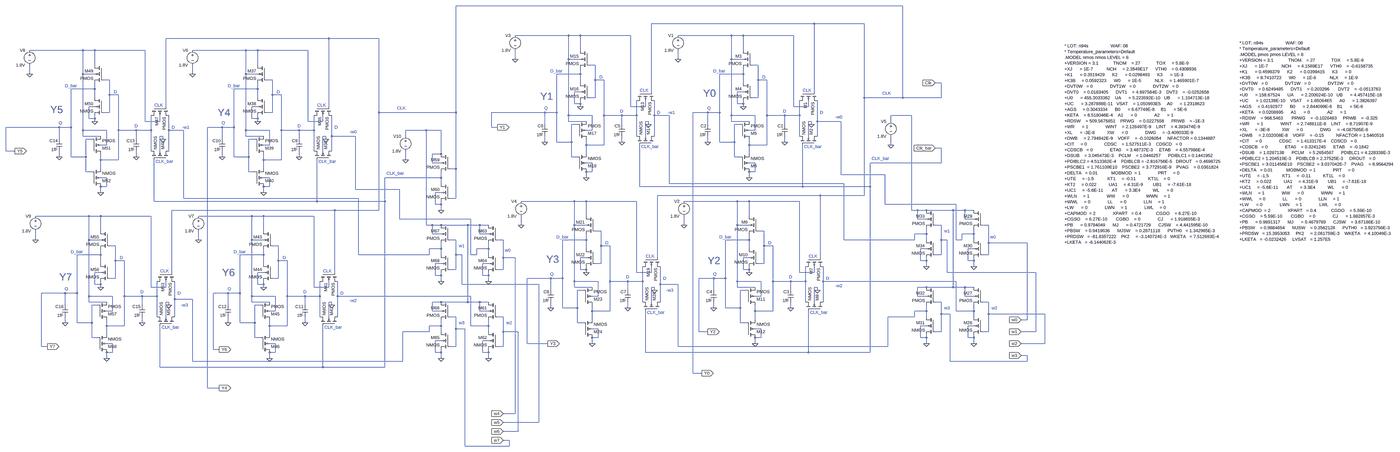
[diagram p0: schematic 8-bit_Memory.asc, whole sheet]
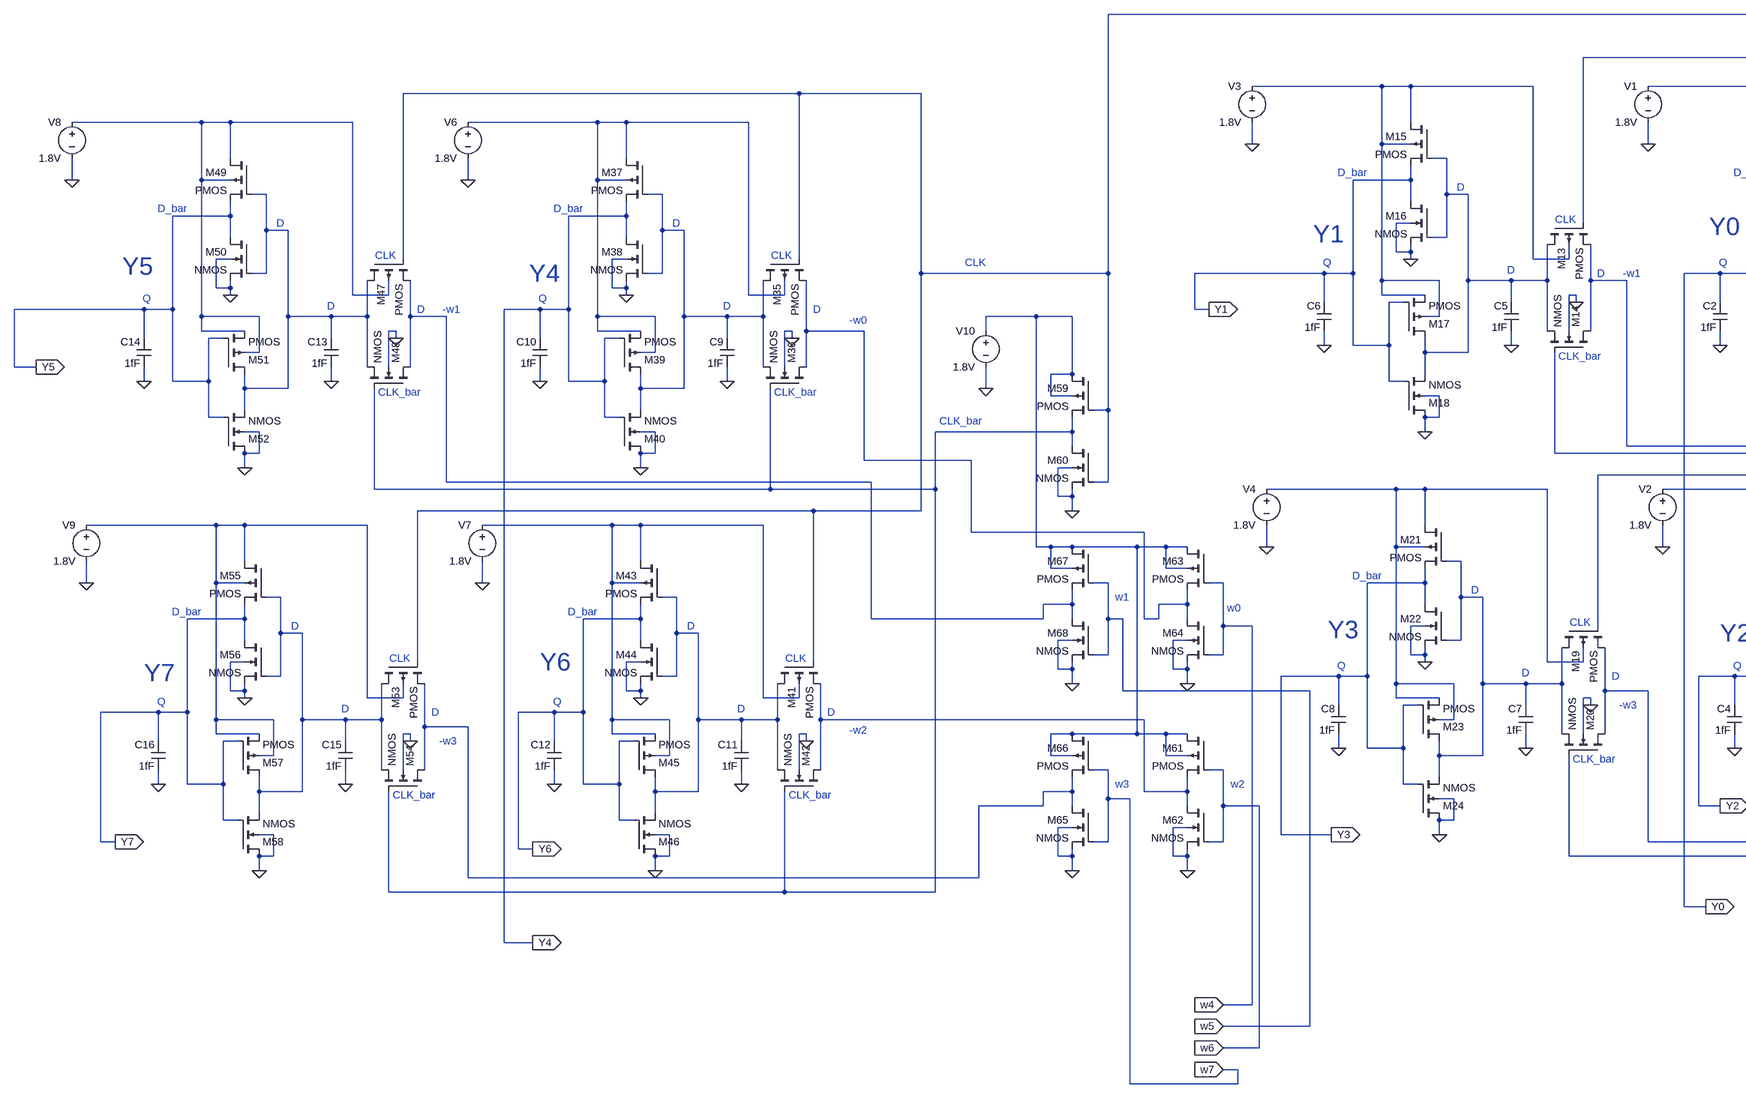
[diagram p1: schematic 8-bit_Memory.asc, part, row 1 of 1, column 1 of 2]
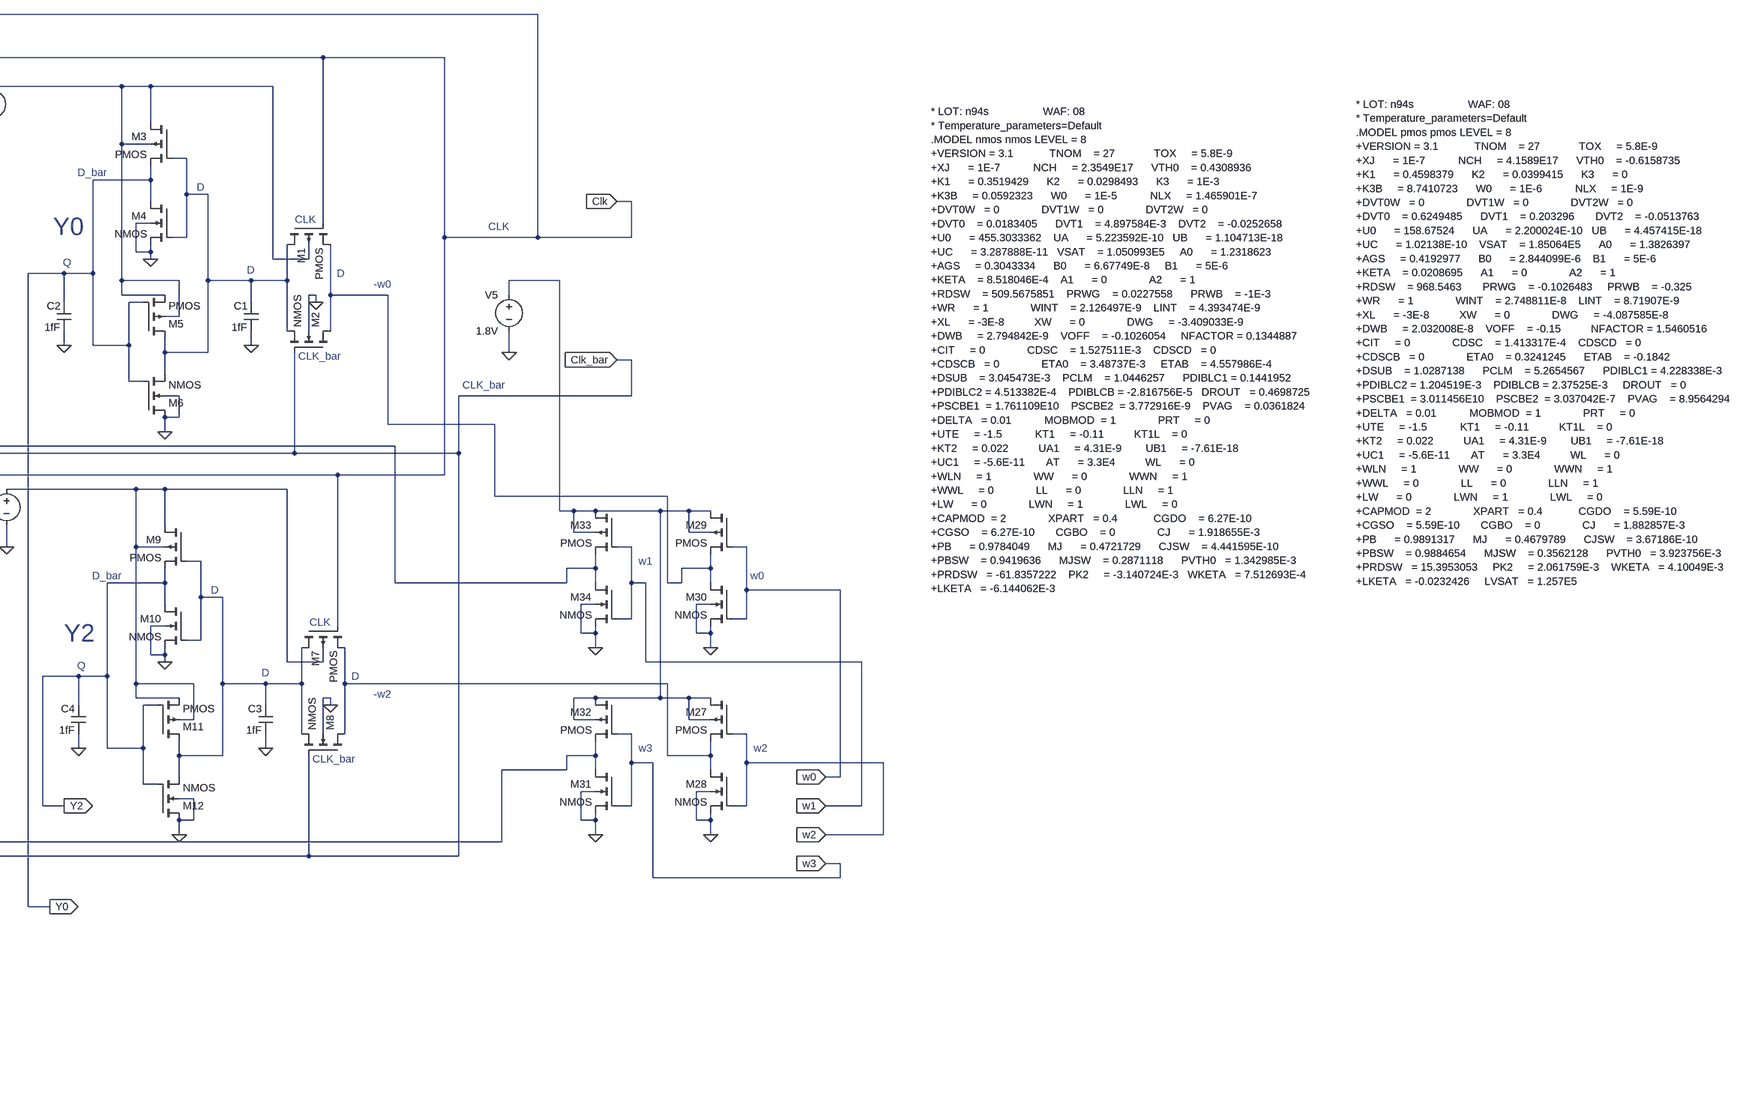
[diagram p2: schematic 8-bit_Memory.asc, part, row 1 of 1, column 2 of 2]
8-bit_Memory.asc, the LTspice schematic file:
Version 4
SHEET 1 5848 1960
WIRE 2896 -480 416 -480
WIRE 2352 -384 1472 -384
WIRE 2688 -384 2352 -384
WIRE 1024 -320 736 -320
WIRE 1088 -320 1024 -320
WIRE 1360 -320 1088 -320
WIRE 1904 -320 1616 -320
WIRE 1968 -320 1904 -320
WIRE 2240 -320 1968 -320
WIRE -336 -304 -1216 -304
WIRE 0 -304 -336 -304
WIRE -1664 -240 -1952 -240
WIRE -1600 -240 -1664 -240
WIRE -1328 -240 -1600 -240
WIRE -784 -240 -1072 -240
WIRE -720 -240 -784 -240
WIRE -448 -240 -720 -240
WIRE 1088 -240 1088 -320
WIRE 1968 -240 1968 -320
WIRE 736 -192 736 -240
WIRE 1024 -192 1024 -320
WIRE 1088 -192 1024 -192
WIRE 1616 -192 1616 -240
WIRE 1904 -192 1904 -320
WIRE 1968 -192 1904 -192
WIRE -1600 -160 -1600 -240
WIRE -720 -160 -720 -240
WIRE 1168 -160 1136 -160
WIRE 2048 -160 2016 -160
WIRE -1952 -112 -1952 -160
WIRE -1664 -112 -1664 -240
WIRE -1600 -112 -1664 -112
WIRE -1072 -112 -1072 -160
WIRE -784 -112 -784 -240
WIRE -720 -112 -784 -112
WIRE 1088 -112 1088 -144
WIRE 1088 -112 960 -112
WIRE 1968 -112 1968 -144
WIRE 1968 -112 1840 -112
WIRE -1520 -80 -1552 -80
WIRE -640 -80 -672 -80
WIRE 1168 -80 1168 -160
WIRE 1216 -80 1168 -80
WIRE 2048 -80 2048 -160
WIRE 2096 -80 2048 -80
WIRE 1088 -64 1088 -112
WIRE 1968 -64 1968 -112
WIRE 3104 -64 3072 -64
WIRE -1600 -32 -1600 -64
WIRE -1600 -32 -1728 -32
WIRE -720 -32 -720 -64
WIRE -720 -32 -848 -32
WIRE 1088 -16 1056 -16
WIRE 1472 -16 1472 -384
WIRE 1968 -16 1936 -16
WIRE 2352 -16 2352 -384
WIRE -1520 0 -1520 -80
WIRE -1472 0 -1520 0
WIRE -640 0 -640 -80
WIRE -592 0 -640 0
WIRE -1600 16 -1600 -32
WIRE -720 16 -720 -32
WIRE 1168 16 1168 -80
WIRE 1168 16 1136 16
WIRE 2048 16 2048 -80
WIRE 2048 16 2016 16
WIRE 2688 16 2688 -384
WIRE 2896 16 2896 -480
WIRE 2896 16 2688 16
WIRE 3104 16 3104 -64
WIRE 3104 16 2896 16
WIRE 1056 48 1056 -16
WIRE 1088 48 1088 32
WIRE 1088 48 1056 48
WIRE 1936 48 1936 -16
WIRE 1968 48 1968 32
WIRE 1968 48 1936 48
WIRE -1600 64 -1632 64
WIRE -1216 64 -1216 -304
WIRE -720 64 -752 64
WIRE -336 64 -336 -304
WIRE 1088 64 1088 48
WIRE 1360 64 1360 -320
WIRE 1440 64 1440 32
WIRE 1440 64 1360 64
WIRE 1968 64 1968 48
WIRE 2240 64 2240 -320
WIRE 2320 64 2320 32
WIRE 2320 64 2240 64
WIRE -1520 96 -1520 0
WIRE -1520 96 -1552 96
WIRE -640 96 -640 0
WIRE -640 96 -672 96
WIRE 0 96 0 -304
WIRE 416 96 416 -480
WIRE 416 96 0 96
WIRE 896 96 608 96
WIRE 960 96 960 -112
WIRE 960 96 896 96
WIRE 1776 96 1696 96
WIRE 1840 96 1840 -112
WIRE 1840 96 1776 96
WIRE 1024 112 1024 -192
WIRE 1152 112 1024 112
WIRE 1216 112 1216 -80
WIRE 1312 112 1216 112
WIRE 1392 112 1392 32
WIRE 1392 112 1312 112
WIRE 1488 112 1488 32
WIRE 1568 112 1488 112
WIRE 1904 112 1904 -192
WIRE 2032 112 1904 112
WIRE 2096 112 2096 -80
WIRE 2192 112 2096 112
WIRE 2272 112 2272 32
WIRE 2272 112 2192 112
WIRE 2944 112 2832 112
WIRE -1632 128 -1632 64
WIRE -1600 128 -1600 112
WIRE -1600 128 -1632 128
WIRE -752 128 -752 64
WIRE -720 128 -720 112
WIRE -720 128 -752 128
WIRE -1600 144 -1600 128
WIRE -1328 144 -1328 -240
WIRE -1248 144 -1248 112
WIRE -1248 144 -1328 144
WIRE -720 144 -720 128
WIRE -448 144 -448 -240
WIRE -368 144 -368 112
WIRE -368 144 -448 144
WIRE 1024 144 1024 112
WIRE 1120 144 1024 144
WIRE 1456 144 1440 144
WIRE 1904 144 1904 112
WIRE 2000 144 1904 144
WIRE 2336 144 2320 144
WIRE 2368 144 2368 32
WIRE 2496 144 2368 144
WIRE 2832 144 2832 112
WIRE 896 160 896 96
WIRE 1072 160 1040 160
WIRE 1312 160 1312 112
WIRE 1456 160 1456 144
WIRE 1776 160 1776 96
WIRE 1952 160 1920 160
WIRE 2192 160 2192 112
WIRE 2336 160 2336 144
WIRE -1792 176 -2080 176
WIRE -1728 176 -1728 -32
WIRE -1728 176 -1792 176
WIRE -912 176 -992 176
WIRE -848 176 -848 -32
WIRE -848 176 -912 176
WIRE 608 176 608 96
WIRE 640 176 608 176
WIRE -1664 192 -1664 -112
WIRE -1536 192 -1664 192
WIRE -1472 192 -1472 0
WIRE -1376 192 -1472 192
WIRE -1296 192 -1296 112
WIRE -1296 192 -1376 192
WIRE -1200 192 -1200 112
WIRE -1120 192 -1200 192
WIRE -784 192 -784 -112
WIRE -656 192 -784 192
WIRE -592 192 -592 0
WIRE -496 192 -592 192
WIRE -416 192 -416 112
WIRE -416 192 -496 192
WIRE 256 192 144 192
WIRE 336 192 256 192
WIRE 1152 192 1152 112
WIRE 1152 192 1120 192
WIRE 2032 192 2032 112
WIRE 2032 192 2000 192
WIRE -1664 224 -1664 192
WIRE -1568 224 -1664 224
WIRE -1232 224 -1248 224
WIRE -784 224 -784 192
WIRE -688 224 -784 224
WIRE -352 224 -368 224
WIRE -320 224 -320 112
WIRE -192 224 -320 224
WIRE 144 224 144 192
WIRE 1392 224 1392 112
WIRE 1440 224 1440 144
WIRE 1488 224 1488 112
WIRE 2272 224 2272 112
WIRE 2320 224 2320 144
WIRE 2368 224 2368 144
WIRE -1792 240 -1792 176
WIRE -1616 240 -1648 240
WIRE -1376 240 -1376 192
WIRE -1232 240 -1232 224
WIRE -912 240 -912 176
WIRE -736 240 -768 240
WIRE -496 240 -496 192
WIRE -352 240 -352 224
WIRE 896 256 896 224
WIRE 960 256 960 96
WIRE 1040 256 1040 160
WIRE 1040 256 960 256
WIRE 1312 256 1312 224
WIRE 1776 256 1776 224
WIRE 1840 256 1840 96
WIRE 1920 256 1920 160
WIRE 1920 256 1840 256
WIRE 2192 256 2192 224
WIRE -1536 272 -1536 192
WIRE -1536 272 -1568 272
WIRE -656 272 -656 192
WIRE -656 272 -688 272
WIRE 1120 272 1120 240
WIRE 1216 272 1216 112
WIRE 1216 272 1120 272
WIRE 2000 272 2000 240
WIRE 2096 272 2096 112
WIRE 2096 272 2000 272
WIRE 2832 272 2832 224
WIRE 3104 288 3072 288
WIRE -2080 304 -2080 176
WIRE -2032 304 -2080 304
WIRE -1296 304 -1296 192
WIRE -1248 304 -1248 224
WIRE -1200 304 -1200 192
WIRE -416 304 -416 192
WIRE -368 304 -368 224
WIRE -320 304 -320 224
WIRE 336 320 336 192
WIRE 336 320 288 320
WIRE 1120 320 1120 272
WIRE 2000 320 2000 272
WIRE -1792 336 -1792 304
WIRE -1728 336 -1728 176
WIRE -1648 336 -1648 240
WIRE -1648 336 -1728 336
WIRE -1376 336 -1376 304
WIRE -912 336 -912 304
WIRE -848 336 -848 176
WIRE -768 336 -768 240
WIRE -768 336 -848 336
WIRE -496 336 -496 304
WIRE 1040 336 1040 256
WIRE 1072 336 1040 336
WIRE 1920 336 1920 256
WIRE 1952 336 1920 336
WIRE -1568 352 -1568 320
WIRE -1472 352 -1472 192
WIRE -1472 352 -1568 352
WIRE -688 352 -688 320
WIRE -592 352 -592 192
WIRE -592 352 -688 352
WIRE 144 352 144 304
WIRE 288 368 288 320
WIRE 336 368 288 368
WIRE 1152 368 1120 368
WIRE 2032 368 2000 368
WIRE 3104 368 3104 288
WIRE 3104 368 2720 368
WIRE -1568 400 -1568 352
WIRE -688 400 -688 352
WIRE 416 400 416 96
WIRE 416 400 384 400
WIRE -1648 416 -1648 336
WIRE -1616 416 -1648 416
WIRE -768 416 -768 336
WIRE -736 416 -768 416
WIRE 1152 416 1152 368
WIRE 1152 416 1120 416
WIRE 2032 416 2032 368
WIRE 2032 416 2000 416
WIRE 2496 432 2496 144
WIRE 2800 432 2496 432
WIRE -1536 448 -1568 448
WIRE -656 448 -688 448
WIRE 336 448 336 416
WIRE 336 448 32 448
WIRE 1120 448 1120 416
WIRE 2000 448 2000 416
WIRE 336 480 336 448
WIRE 1568 480 1568 112
WIRE 2512 480 1568 480
WIRE -1536 496 -1536 448
WIRE -1536 496 -1568 496
WIRE -656 496 -656 448
WIRE -656 496 -688 496
WIRE 1408 496 1408 272
WIRE 2288 496 2288 272
WIRE 2288 496 1408 496
WIRE 2720 496 2720 368
WIRE 2720 496 2288 496
WIRE -192 512 -192 224
WIRE 112 512 -192 512
WIRE -1568 528 -1568 496
WIRE -688 528 -688 496
WIRE 336 528 304 528
WIRE 2384 544 1504 544
WIRE 2688 544 2688 16
WIRE 2688 544 2384 544
WIRE -1120 560 -1120 192
WIRE -176 560 -1120 560
WIRE 416 560 416 400
WIRE 416 560 384 560
WIRE -1280 576 -1280 352
WIRE -400 576 -400 352
WIRE -400 576 -1280 576
WIRE 32 576 32 448
WIRE 32 576 -400 576
WIRE 1056 576 768 576
WIRE 1120 576 1056 576
WIRE 1392 576 1120 576
WIRE 1936 576 1648 576
WIRE 2000 576 1936 576
WIRE 2272 576 2000 576
WIRE 304 592 304 528
WIRE 336 592 336 576
WIRE 336 592 304 592
WIRE 2800 592 2800 432
WIRE 3184 592 2800 592
WIRE -304 624 -1184 624
WIRE 0 624 0 96
WIRE 0 624 -304 624
WIRE 336 624 336 592
WIRE 2944 624 2944 112
WIRE 2976 624 2944 624
WIRE 3024 624 2976 624
WIRE 3168 624 3024 624
WIRE 3232 624 3168 624
WIRE 3280 624 3232 624
WIRE -1632 656 -1920 656
WIRE -1568 656 -1632 656
WIRE -1296 656 -1568 656
WIRE -752 656 -1040 656
WIRE -688 656 -752 656
WIRE -416 656 -688 656
WIRE 1120 656 1120 576
WIRE 2000 656 2000 576
WIRE 112 672 112 512
WIRE 496 672 112 672
WIRE 2976 672 2976 624
WIRE 3024 672 2976 672
WIRE 3232 672 3232 624
WIRE 3280 672 3232 672
WIRE 256 704 256 192
WIRE 288 704 256 704
WIRE 336 704 288 704
WIRE 480 704 336 704
WIRE 544 704 480 704
WIRE 592 704 544 704
WIRE 768 704 768 656
WIRE 1056 704 1056 576
WIRE 1120 704 1056 704
WIRE 1648 704 1648 656
WIRE 1936 704 1936 576
WIRE 2000 704 1936 704
WIRE 3104 704 3072 704
WIRE 3360 704 3328 704
WIRE -1568 736 -1568 656
WIRE -688 736 -688 656
WIRE 1200 736 1168 736
WIRE 2080 736 2048 736
WIRE 288 752 288 704
WIRE 336 752 288 752
WIRE 544 752 544 704
WIRE 592 752 544 752
WIRE 3024 752 3024 720
WIRE 3024 752 2960 752
WIRE 3280 752 3280 720
WIRE 3280 752 3216 752
WIRE -1920 784 -1920 736
WIRE -1632 784 -1632 656
WIRE -1568 784 -1632 784
WIRE -1040 784 -1040 736
WIRE -752 784 -752 656
WIRE -688 784 -752 784
WIRE 416 784 384 784
WIRE 672 784 640 784
WIRE 1120 784 1120 752
WIRE 1120 784 992 784
WIRE 2000 784 2000 752
WIRE 2000 784 1872 784
WIRE 2512 784 2512 480
WIRE 2960 784 2960 752
WIRE 2960 784 2512 784
WIRE 3024 784 3024 752
WIRE 3104 784 3104 704
WIRE 3136 784 3104 784
WIRE 3184 784 3184 592
WIRE 3216 784 3216 752
WIRE 3216 784 3184 784
WIRE 3280 784 3280 752
WIRE 3360 800 3360 704
WIRE 3568 800 3360 800
WIRE -1488 816 -1520 816
WIRE -608 816 -640 816
WIRE 1200 816 1200 736
WIRE 1248 816 1200 816
WIRE 2080 816 2080 736
WIRE 2128 816 2080 816
WIRE 336 832 336 800
WIRE 336 832 272 832
WIRE 592 832 592 800
WIRE 592 832 528 832
WIRE 1120 832 1120 784
WIRE 2000 832 2000 784
WIRE 3024 832 2992 832
WIRE 3280 832 3248 832
WIRE -1568 864 -1568 832
WIRE -1568 864 -1696 864
WIRE -688 864 -688 832
WIRE -688 864 -816 864
WIRE -176 864 -176 560
WIRE 272 864 272 832
WIRE 272 864 -176 864
WIRE 336 864 336 832
WIRE 416 864 416 784
WIRE 448 864 416 864
WIRE 496 864 496 672
WIRE 528 864 528 832
WIRE 528 864 496 864
WIRE 592 864 592 832
WIRE 3104 864 3104 784
WIRE 3104 864 3072 864
WIRE 3360 864 3360 800
WIRE 3360 864 3328 864
WIRE 672 880 672 784
WIRE 736 880 672 880
WIRE 1120 880 1088 880
WIRE 1504 880 1504 544
WIRE 2000 880 1968 880
WIRE 2384 880 2384 544
WIRE -1488 896 -1488 816
WIRE -1440 896 -1488 896
WIRE -608 896 -608 816
WIRE -560 896 -608 896
WIRE 2992 896 2992 832
WIRE 3024 896 3024 880
WIRE 3024 896 2992 896
WIRE 3248 896 3248 832
WIRE 3280 896 3280 880
WIRE 3280 896 3248 896
WIRE -1568 912 -1568 864
WIRE -688 912 -688 864
WIRE 336 912 304 912
WIRE 592 912 560 912
WIRE 1200 912 1200 816
WIRE 1200 912 1168 912
WIRE 2080 912 2080 816
WIRE 2080 912 2048 912
WIRE 3024 928 3024 896
WIRE 3280 928 3280 896
WIRE 416 944 416 864
WIRE 416 944 384 944
WIRE 672 944 672 880
WIRE 672 944 640 944
WIRE 1088 944 1088 880
WIRE 1120 944 1120 928
WIRE 1120 944 1088 944
WIRE 1968 944 1968 880
WIRE 2000 944 2000 928
WIRE 2000 944 1968 944
WIRE -1568 960 -1600 960
WIRE -1184 960 -1184 624
WIRE -688 960 -720 960
WIRE -304 960 -304 624
WIRE 1120 960 1120 944
WIRE 1392 960 1392 576
WIRE 1472 960 1472 928
WIRE 1472 960 1392 960
WIRE 2000 960 2000 944
WIRE 2272 960 2272 576
WIRE 2352 960 2352 928
WIRE 2352 960 2272 960
WIRE 3136 960 3136 784
WIRE 3616 960 3136 960
WIRE 304 976 304 912
WIRE 336 976 336 960
WIRE 336 976 304 976
WIRE 560 976 560 912
WIRE 592 976 592 960
WIRE 592 976 560 976
WIRE -1488 992 -1488 896
WIRE -1488 992 -1520 992
WIRE -608 992 -608 896
WIRE -608 992 -640 992
WIRE 928 992 800 992
WIRE 992 992 992 784
WIRE 992 992 928 992
WIRE 1808 992 1728 992
WIRE 1872 992 1872 784
WIRE 1872 992 1808 992
WIRE 336 1008 336 976
WIRE 592 1008 592 976
WIRE 1056 1008 1056 704
WIRE 1184 1008 1056 1008
WIRE 1248 1008 1248 816
WIRE 1344 1008 1248 1008
WIRE 1424 1008 1424 928
WIRE 1424 1008 1344 1008
WIRE 1936 1008 1936 704
WIRE 2064 1008 1936 1008
WIRE 2128 1008 2128 816
WIRE 2224 1008 2128 1008
WIRE 2304 1008 2304 928
WIRE 2304 1008 2224 1008
WIRE 2400 1008 2400 928
WIRE 3184 1008 2400 1008
WIRE -1600 1024 -1600 960
WIRE -1568 1024 -1568 1008
WIRE -1568 1024 -1600 1024
WIRE -720 1024 -720 960
WIRE -688 1024 -688 1008
WIRE -688 1024 -720 1024
WIRE 448 1024 448 864
WIRE 864 1024 448 1024
WIRE 1520 1024 1520 928
WIRE 1616 1024 1520 1024
WIRE -1568 1040 -1568 1024
WIRE -1296 1040 -1296 656
WIRE -1216 1040 -1216 1008
WIRE -1216 1040 -1296 1040
WIRE -688 1040 -688 1024
WIRE -416 1040 -416 656
WIRE -336 1040 -336 1008
WIRE -336 1040 -416 1040
WIRE 1056 1040 1056 1008
WIRE 1152 1040 1056 1040
WIRE 1488 1040 1472 1040
WIRE 1936 1040 1936 1008
WIRE 2032 1040 1936 1040
WIRE 2368 1040 2352 1040
WIRE 3024 1040 2976 1040
WIRE 3168 1040 3168 624
WIRE 3168 1040 3024 1040
WIRE 3232 1040 3168 1040
WIRE 3280 1040 3232 1040
WIRE 928 1056 928 992
WIRE 1104 1056 1072 1056
WIRE 1344 1056 1344 1008
WIRE 1488 1056 1488 1040
WIRE 1808 1056 1808 992
WIRE 1984 1056 1952 1056
WIRE 2224 1056 2224 1008
WIRE 2368 1056 2368 1040
WIRE -1760 1072 -1888 1072
WIRE -1696 1072 -1696 864
WIRE -1696 1072 -1760 1072
WIRE -880 1072 -960 1072
WIRE -816 1072 -816 864
WIRE -816 1072 -880 1072
WIRE -1632 1088 -1632 784
WIRE -1504 1088 -1632 1088
WIRE -1440 1088 -1440 896
WIRE -1344 1088 -1440 1088
WIRE -1264 1088 -1264 1008
WIRE -1264 1088 -1344 1088
WIRE -752 1088 -752 784
WIRE -624 1088 -752 1088
WIRE -560 1088 -560 896
WIRE -464 1088 -560 1088
WIRE -384 1088 -384 1008
WIRE -384 1088 -464 1088
WIRE -288 1088 -288 1008
WIRE 496 1088 -288 1088
WIRE 1184 1088 1184 1008
WIRE 1184 1088 1152 1088
WIRE 2064 1088 2064 1008
WIRE 2064 1088 2032 1088
WIRE 2976 1088 2976 1040
WIRE 3024 1088 2976 1088
WIRE 3232 1088 3232 1040
WIRE 3280 1088 3232 1088
WIRE -1168 1104 -1168 1008
WIRE -1072 1104 -1168 1104
WIRE -1632 1120 -1632 1088
WIRE -1536 1120 -1632 1120
WIRE -1200 1120 -1216 1120
WIRE -752 1120 -752 1088
WIRE -656 1120 -752 1120
WIRE -320 1120 -336 1120
WIRE 336 1120 288 1120
WIRE 480 1120 480 704
WIRE 480 1120 336 1120
WIRE 544 1120 480 1120
WIRE 592 1120 544 1120
WIRE 1424 1120 1424 1008
WIRE 1472 1120 1472 1040
WIRE 1520 1120 1520 1024
WIRE 2304 1120 2304 1008
WIRE 2352 1120 2352 1040
WIRE 2400 1120 2400 1008
WIRE 3104 1120 3072 1120
WIRE 3360 1120 3328 1120
WIRE -1760 1136 -1760 1072
WIRE -1584 1136 -1616 1136
WIRE -1344 1136 -1344 1088
WIRE -1200 1136 -1200 1120
WIRE -880 1136 -880 1072
WIRE -704 1136 -736 1136
WIRE -464 1136 -464 1088
WIRE -320 1136 -320 1120
WIRE 928 1152 928 1120
WIRE 992 1152 992 992
WIRE 1072 1152 1072 1056
WIRE 1072 1152 992 1152
WIRE 1344 1152 1344 1120
WIRE 1808 1152 1808 1120
WIRE 1872 1152 1872 992
WIRE 1952 1152 1952 1056
WIRE 1952 1152 1872 1152
WIRE 2224 1152 2224 1120
WIRE -1504 1168 -1504 1088
WIRE -1504 1168 -1536 1168
WIRE -624 1168 -624 1088
WIRE -624 1168 -656 1168
WIRE 288 1168 288 1120
WIRE 336 1168 288 1168
WIRE 544 1168 544 1120
WIRE 592 1168 544 1168
WIRE 1152 1168 1152 1136
WIRE 1248 1168 1248 1008
WIRE 1248 1168 1152 1168
WIRE 2032 1168 2032 1136
WIRE 2128 1168 2128 1008
WIRE 2128 1168 2032 1168
WIRE 3024 1168 3024 1136
WIRE 3024 1168 2960 1168
WIRE 3184 1168 3184 1008
WIRE 3280 1168 3280 1136
WIRE 3280 1168 3184 1168
WIRE 3104 1184 3104 1120
WIRE 3152 1184 3104 1184
WIRE 3360 1184 3360 1120
WIRE 3664 1184 3360 1184
WIRE -1264 1200 -1264 1088
WIRE -1216 1200 -1216 1120
WIRE -1168 1200 -1168 1104
WIRE -384 1200 -384 1088
WIRE -336 1200 -336 1120
WIRE -288 1200 -288 1088
WIRE 416 1200 384 1200
WIRE 672 1200 640 1200
WIRE 2960 1200 2960 1168
WIRE 2960 1200 2816 1200
WIRE 3024 1200 3024 1168
WIRE 3280 1200 3280 1168
WIRE 1152 1216 1152 1168
WIRE 2032 1216 2032 1168
WIRE 3568 1216 3568 800
WIRE 3568 1216 3536 1216
WIRE -1760 1232 -1760 1200
WIRE -1696 1232 -1696 1072
WIRE -1616 1232 -1616 1136
WIRE -1616 1232 -1696 1232
WIRE -1344 1232 -1344 1200
WIRE -880 1232 -880 1200
WIRE -816 1232 -816 1072
WIRE -736 1232 -736 1136
WIRE -736 1232 -816 1232
WIRE -464 1232 -464 1200
WIRE 1072 1232 1072 1152
WIRE 1104 1232 1072 1232
WIRE 1952 1232 1952 1152
WIRE 1984 1232 1952 1232
WIRE -1536 1248 -1536 1216
WIRE -1440 1248 -1440 1088
WIRE -1440 1248 -1536 1248
WIRE -656 1248 -656 1216
WIRE -560 1248 -560 1088
WIRE -560 1248 -656 1248
WIRE 336 1248 336 1216
WIRE 336 1248 272 1248
WIRE 496 1248 496 1088
WIRE 592 1248 592 1216
WIRE 592 1248 496 1248
WIRE 3024 1248 2992 1248
WIRE 3280 1248 3248 1248
WIRE 416 1264 416 1200
WIRE 464 1264 416 1264
WIRE 1184 1264 1152 1264
WIRE 2064 1264 2032 1264
WIRE 272 1280 272 1248
WIRE 272 1280 128 1280
WIRE 336 1280 336 1248
WIRE 592 1280 592 1248
WIRE 672 1280 672 1200
WIRE 752 1280 672 1280
WIRE 1728 1280 1728 992
WIRE 1776 1280 1728 1280
WIRE 3104 1280 3104 1184
WIRE 3104 1280 3072 1280
WIRE 3360 1280 3360 1184
WIRE 3360 1280 3328 1280
WIRE 3616 1280 3616 960
WIRE 3616 1280 3536 1280
WIRE -1536 1296 -1536 1248
WIRE -656 1296 -656 1248
WIRE -1616 1312 -1616 1232
WIRE -1584 1312 -1616 1312
WIRE -736 1312 -736 1232
WIRE -704 1312 -736 1312
WIRE 1184 1312 1184 1264
WIRE 1184 1312 1152 1312
WIRE 2064 1312 2064 1264
WIRE 2064 1312 2032 1312
WIRE 2992 1312 2992 1248
WIRE 3024 1312 3024 1296
WIRE 3024 1312 2992 1312
WIRE 3248 1312 3248 1248
WIRE 3280 1312 3280 1296
WIRE 3280 1312 3248 1312
WIRE 336 1328 304 1328
WIRE 592 1328 560 1328
WIRE -1504 1344 -1536 1344
WIRE -624 1344 -656 1344
WIRE 800 1344 800 992
WIRE 912 1344 800 1344
WIRE 1152 1344 1152 1312
WIRE 2032 1344 2032 1312
WIRE 3024 1344 3024 1312
WIRE 3280 1344 3280 1312
WIRE 3664 1344 3664 1184
WIRE 3664 1344 3536 1344
WIRE -1888 1360 -1888 1072
WIRE -1856 1360 -1888 1360
WIRE 416 1360 416 1264
WIRE 416 1360 384 1360
WIRE 672 1360 672 1280
WIRE 672 1360 640 1360
WIRE 1616 1360 1616 1024
WIRE 2816 1360 2816 1200
WIRE 2816 1360 1616 1360
WIRE -960 1376 -960 1072
WIRE -928 1376 -960 1376
WIRE -1504 1392 -1504 1344
WIRE -1504 1392 -1536 1392
WIRE -624 1392 -624 1344
WIRE -624 1392 -656 1392
WIRE 304 1392 304 1328
WIRE 336 1392 336 1376
WIRE 336 1392 304 1392
WIRE 560 1392 560 1328
WIRE 592 1392 592 1376
WIRE 592 1392 560 1392
WIRE 1440 1392 1440 1168
WIRE 2320 1392 2320 1168
WIRE 2320 1392 1440 1392
WIRE 2720 1392 2720 496
WIRE 2720 1392 2320 1392
WIRE 3568 1408 3536 1408
WIRE -1536 1424 -1536 1392
WIRE -656 1424 -656 1392
WIRE 336 1424 336 1392
WIRE 592 1424 592 1392
WIRE -1072 1440 -1072 1104
WIRE 128 1440 128 1280
WIRE 128 1440 -1072 1440
WIRE 3152 1440 3152 1184
WIRE 3568 1440 3568 1408
WIRE 3568 1440 3152 1440
WIRE -1248 1472 -1248 1248
WIRE -368 1472 -368 1248
WIRE -368 1472 -1248 1472
WIRE 32 1472 32 576
WIRE 32 1472 -368 1472
WIRE 1696 1504 1696 96
WIRE 1744 1504 1696 1504
WIRE -992 1584 -992 176
WIRE -928 1584 -992 1584
WIRE 736 1744 736 880
WIRE 736 1744 672 1744
WIRE 864 1792 864 1024
WIRE 864 1792 672 1792
WIRE 752 1840 752 1280
WIRE 752 1840 672 1840
WIRE 704 1888 672 1888
WIRE 464 1920 464 1264
WIRE 704 1920 704 1888
WIRE 704 1920 464 1920
FLAG 1616 -192 0
FLAG 1968 64 0
FLAG 2000 448 0
FLAG 2336 160 0
FLAG 2192 256 0
FLAG 1776 256 0
FLAG 1648 704 0
FLAG 2000 960 0
FLAG 2032 1344 0
FLAG 2368 1056 0
FLAG 2224 1152 0
FLAG 1808 1152 0
FLAG 736 -192 0
FLAG 1088 64 0
FLAG 1120 448 0
FLAG 1456 160 0
FLAG 1312 256 0
FLAG 896 256 0
FLAG 768 704 0
FLAG 1120 960 0
FLAG 1152 1344 0
FLAG 1488 1056 0
FLAG 1344 1152 0
FLAG 928 1152 0
FLAG 2832 272 0
FLAG 3024 928 0
FLAG 3280 928 0
FLAG 3024 1344 0
FLAG 3280 1344 0
FLAG -1072 -112 0
FLAG -720 144 0
FLAG -688 528 0
FLAG -352 240 0
FLAG -496 336 0
FLAG -912 336 0
FLAG -1040 784 0
FLAG -688 1040 0
FLAG -656 1424 0
FLAG -320 1136 0
FLAG -464 1232 0
FLAG -880 1232 0
FLAG -1952 -112 0
FLAG -1600 144 0
FLAG -1568 528 0
FLAG -1232 240 0
FLAG -1376 336 0
FLAG -1792 336 0
FLAG -1920 784 0
FLAG -1568 1040 0
FLAG -1536 1424 0
FLAG -1200 1136 0
FLAG -1344 1232 0
FLAG -1760 1232 0
FLAG 144 352 0
FLAG 336 624 0
FLAG 336 1008 0
FLAG 592 1008 0
FLAG 336 1424 0
FLAG 592 1424 0
FLAG 3072 -64 Clk
IOPIN 3072 -64 In
FLAG 3072 288 Clk_bar
IOPIN 3072 288 In
FLAG 3536 1216 w0
IOPIN 3536 1216 In
FLAG 3536 1280 w1
IOPIN 3536 1280 In
FLAG 3536 1344 w2
IOPIN 3536 1344 In
FLAG 3536 1408 w3
IOPIN 3536 1408 In
FLAG 672 1744 w4
IOPIN 672 1744 In
FLAG 672 1792 w5
IOPIN 672 1792 In
FLAG 672 1840 w6
IOPIN 672 1840 In
FLAG 672 1888 w7
IOPIN 672 1888 In
FLAG 1744 1504 Y0
IOPIN 1744 1504 Out
FLAG 640 176 Y1
IOPIN 640 176 Out
FLAG 1776 1280 Y2
IOPIN 1776 1280 Out
FLAG 912 1344 Y3
IOPIN 912 1344 Out
FLAG -928 1584 Y4
IOPIN -928 1584 Out
FLAG -2032 304 Y5
IOPIN -2032 304 Out
FLAG -928 1376 Y6
IOPIN -928 1376 Out
FLAG -1856 1360 Y7
IOPIN -1856 1360 Out
DATAFLAG 1808 96 ""
DATAFLAG -880 176 ""
DATAFLAG 416 240 ""
SYMBOL pmos4 2272 -16 M90
SYMATTR InstName M1
SYMATTR Value2 l=180n w=6000n
SYMBOL nmos4 2368 272 M270
SYMATTR InstName M2
SYMATTR Value2 l=180n w=6000n
SYMBOL pmos4 2016 -240 M0
SYMATTR InstName M3
SYMATTR Value2 l=180n w=3520n
SYMBOL nmos4 2016 -64 M0
SYMATTR InstName M4
SYMATTR Value2 l=180n w=1760n
SYMBOL pmos4 1952 240 M180
SYMATTR InstName M5
SYMATTR Value2 l=180n w=880n
SYMBOL nmos4 1952 416 M180
SYMATTR InstName M6
SYMATTR Value2 l=180n w=440n
SYMBOL voltage 1616 -336 M0
WINDOW 123 0 0 Left 0
WINDOW 39 0 0 Left 0
SYMATTR InstName V1
SYMATTR Value 1.8V
SYMBOL cap 2208 160 M0
SYMATTR InstName C1
SYMATTR Value 1fF
SYMBOL cap 1792 160 M0
SYMATTR InstName C2
SYMATTR Value 1fF
SYMBOL pmos4 2304 880 M90
SYMATTR InstName M7
SYMATTR Value2 l=180n w=6000n
SYMBOL nmos4 2400 1168 M270
SYMATTR InstName M8
SYMATTR Value2 l=180n w=6000n
SYMBOL pmos4 2048 656 M0
SYMATTR InstName M9
SYMATTR Value2 l=180n w=3520n
SYMBOL nmos4 2048 832 M0
SYMATTR InstName M10
SYMATTR Value2 l=180n w=1760n
SYMBOL pmos4 1984 1136 M180
SYMATTR InstName M11
SYMATTR Value2 l=180n w=880n
SYMBOL nmos4 1984 1312 M180
SYMATTR InstName M12
SYMATTR Value2 l=180n w=440n
SYMBOL voltage 1648 560 M0
WINDOW 123 0 0 Left 0
WINDOW 39 0 0 Left 0
SYMATTR InstName V2
SYMATTR Value 1.8V
SYMBOL cap 2240 1056 M0
SYMATTR InstName C3
SYMATTR Value 1fF
SYMBOL cap 1824 1056 M0
SYMATTR InstName C4
SYMATTR Value 1fF
SYMBOL pmos4 1392 -16 M90
SYMATTR InstName M13
SYMATTR Value2 l=180n w=6000n
SYMBOL nmos4 1488 272 M270
SYMATTR InstName M14
SYMATTR Value2 l=180n w=6000n
SYMBOL pmos4 1136 -240 M0
SYMATTR InstName M15
SYMATTR Value2 l=180n w=3520n
SYMBOL nmos4 1136 -64 M0
SYMATTR InstName M16
SYMATTR Value2 l=180n w=1760n
SYMBOL pmos4 1072 240 M180
SYMATTR InstName M17
SYMATTR Value2 l=180n w=880n
SYMBOL nmos4 1072 416 M180
SYMATTR InstName M18
SYMATTR Value2 l=180n w=440n
SYMBOL voltage 736 -336 M0
WINDOW 123 0 0 Left 0
WINDOW 39 0 0 Left 0
SYMATTR InstName V3
SYMATTR Value 1.8V
SYMBOL cap 1328 160 M0
SYMATTR InstName C5
SYMATTR Value 1fF
SYMBOL cap 912 160 M0
SYMATTR InstName C6
SYMATTR Value 1fF
SYMBOL pmos4 1424 880 M90
SYMATTR InstName M19
SYMATTR Value2 l=180n w=6000n
SYMBOL nmos4 1520 1168 M270
SYMATTR InstName M20
SYMATTR Value2 l=180n w=6000n
SYMBOL pmos4 1168 656 M0
SYMATTR InstName M21
SYMATTR Value2 l=180n w=3520n
SYMBOL nmos4 1168 832 M0
SYMATTR InstName M22
SYMATTR Value2 l=180n w=1760n
SYMBOL pmos4 1104 1136 M180
SYMATTR InstName M23
SYMATTR Value2 l=180n w=880n
SYMBOL nmos4 1104 1312 M180
SYMATTR InstName M24
SYMATTR Value2 l=180n w=440n
SYMBOL voltage 768 560 M0
WINDOW 123 0 0 Left 0
WINDOW 39 0 0 Left 0
SYMATTR InstName V4
SYMATTR Value 1.8V
SYMBOL cap 1360 1056 M0
SYMATTR InstName C7
SYMATTR Value 1fF
SYMBOL cap 944 1056 M0
SYMATTR InstName C8
SYMATTR Value 1fF
SYMBOL voltage 2832 128 M0
WINDOW 123 0 0 Left 0
WINDOW 39 0 0 Left 0
SYMATTR InstName V5
SYMATTR Value 1.8V
SYMBOL pmos4 3328 1040 M0
SYMATTR InstName M27
SYMATTR Value2 l=180n w=4000n
SYMBOL nmos4 3328 1200 M0
SYMATTR InstName M28
SYMATTR Value2 l=180n w=2000n
SYMBOL pmos4 3328 624 M0
SYMATTR InstName M29
SYMATTR Value2 l=180n w=4000n
SYMBOL nmos4 3328 784 M0
SYMATTR InstName M30
SYMATTR Value2 l=180n w=2000n
SYMBOL nmos4 3072 1200 M0
SYMATTR InstName M31
SYMATTR Value2 l=180n w=2000n
SYMBOL pmos4 3072 1040 M0
SYMATTR InstName M32
SYMATTR Value2 l=180n w=4000n
SYMBOL pmos4 3072 624 M0
SYMATTR InstName M33
SYMATTR Value2 l=180n w=4000n
SYMBOL nmos4 3072 784 M0
SYMATTR InstName M34
SYMATTR Value2 l=180n w=2000n
SYMBOL pmos4 -416 64 M90
SYMATTR InstName M35
SYMATTR Value2 l=180n w=6000n
SYMBOL nmos4 -320 352 M270
SYMATTR InstName M36
SYMATTR Value2 l=180n w=6000n
SYMBOL pmos4 -672 -160 M0
SYMATTR InstName M37
SYMATTR Value2 l=180n w=3520n
SYMBOL nmos4 -672 16 M0
SYMATTR InstName M38
SYMATTR Value2 l=180n w=1760n
SYMBOL pmos4 -736 320 M180
SYMATTR InstName M39
SYMATTR Value2 l=180n w=880n
SYMBOL nmos4 -736 496 M180
SYMATTR InstName M40
SYMATTR Value2 l=180n w=440n
SYMBOL voltage -1072 -256 M0
WINDOW 123 0 0 Left 0
WINDOW 39 0 0 Left 0
SYMATTR InstName V6
SYMATTR Value 1.8V
SYMBOL cap -480 240 M0
SYMATTR InstName C9
SYMATTR Value 1fF
SYMBOL cap -896 240 M0
SYMATTR InstName C10
SYMATTR Value 1fF
SYMBOL pmos4 -384 960 M90
SYMATTR InstName M41
SYMATTR Value2 l=180n w=6000n
SYMBOL nmos4 -288 1248 M270
SYMATTR InstName M42
SYMATTR Value2 l=180n w=6000n
SYMBOL pmos4 -640 736 M0
SYMATTR InstName M43
SYMATTR Value2 l=180n w=3520n
SYMBOL nmos4 -640 912 M0
SYMATTR InstName M44
SYMATTR Value2 l=180n w=1760n
SYMBOL pmos4 -704 1216 M180
SYMATTR InstName M45
SYMATTR Value2 l=180n w=880n
SYMBOL nmos4 -704 1392 M180
SYMATTR InstName M46
SYMATTR Value2 l=180n w=440n
SYMBOL voltage -1040 640 M0
WINDOW 123 0 0 Left 0
WINDOW 39 0 0 Left 0
SYMATTR InstName V7
SYMATTR Value 1.8V
SYMBOL cap -448 1136 M0
SYMATTR InstName C11
SYMATTR Value 1fF
SYMBOL cap -864 1136 M0
SYMATTR InstName C12
SYMATTR Value 1fF
SYMBOL pmos4 -1296 64 M90
SYMATTR InstName M47
SYMATTR Value2 l=180n w=6000n
SYMBOL nmos4 -1200 352 M270
SYMATTR InstName M48
SYMATTR Value2 l=180n w=6000n
SYMBOL pmos4 -1552 -160 M0
SYMATTR InstName M49
SYMATTR Value2 l=180n w=3520n
SYMBOL nmos4 -1552 16 M0
SYMATTR InstName M50
SYMATTR Value2 l=180n w=1760n
SYMBOL pmos4 -1616 320 M180
SYMATTR InstName M51
SYMATTR Value2 l=180n w=880n
SYMBOL nmos4 -1616 496 M180
SYMATTR InstName M52
SYMATTR Value2 l=180n w=440n
SYMBOL voltage -1952 -256 M0
WINDOW 123 0 0 Left 0
WINDOW 39 0 0 Left 0
SYMATTR InstName V8
SYMATTR Value 1.8V
SYMBOL cap -1360 240 M0
SYMATTR InstName C13
SYMATTR Value 1fF
SYMBOL cap -1776 240 M0
SYMATTR InstName C14
SYMATTR Value 1fF
SYMBOL pmos4 -1264 960 M90
SYMATTR InstName M53
SYMATTR Value2 l=180n w=6000n
SYMBOL nmos4 -1168 1248 M270
SYMATTR InstName M54
SYMATTR Value2 l=180n w=6000n
SYMBOL pmos4 -1520 736 M0
SYMATTR InstName M55
SYMATTR Value2 l=180n w=3520n
SYMBOL nmos4 -1520 912 M0
SYMATTR InstName M56
SYMATTR Value2 l=180n w=1760n
SYMBOL pmos4 -1584 1216 M180
SYMATTR InstName M57
SYMATTR Value2 l=180n w=880n
SYMBOL nmos4 -1584 1392 M180
SYMATTR InstName M58
SYMATTR Value2 l=180n w=440n
SYMBOL voltage -1920 640 M0
WINDOW 123 0 0 Left 0
WINDOW 39 0 0 Left 0
SYMATTR InstName V9
SYMATTR Value 1.8V
SYMBOL cap -1328 1136 M0
SYMATTR InstName C15
SYMATTR Value 1fF
SYMBOL cap -1744 1136 M0
SYMATTR InstName C16
SYMATTR Value 1fF
SYMBOL voltage 144 208 M0
WINDOW 123 0 0 Left 0
WINDOW 39 0 0 Left 0
SYMATTR InstName V10
SYMATTR Value 1.8V
SYMBOL pmos4 384 320 M0
SYMATTR InstName M59
SYMATTR Value2 l=180n w=8800n
SYMBOL nmos4 384 480 M0
SYMATTR InstName M60
SYMATTR Value2 l=180n w=4400n
SYMBOL pmos4 640 1120 M0
SYMATTR InstName M61
SYMATTR Value2 l=180n w=4000n
SYMBOL nmos4 640 1280 M0
SYMATTR InstName M62
SYMATTR Value2 l=180n w=2000n
SYMBOL pmos4 640 704 M0
SYMATTR InstName M63
SYMATTR Value2 l=180n w=4000n
SYMBOL nmos4 640 864 M0
SYMATTR InstName M64
SYMATTR Value2 l=180n w=2000n
SYMBOL nmos4 384 1280 M0
SYMATTR InstName M65
SYMATTR Value2 l=180n w=2000n
SYMBOL pmos4 384 1120 M0
SYMATTR InstName M66
SYMATTR Value2 l=180n w=4000n
SYMBOL pmos4 384 704 M0
SYMATTR InstName M67
SYMATTR Value2 l=180n w=4000n
SYMBOL nmos4 384 864 M0
SYMATTR InstName M68
SYMATTR Value2 l=180n w=2000n
TEXT 2336 -24 Right 2 ;CLK
TEXT 2392 280 Right 2 ;CLK_bar
TEXT 1872 -128 Right 2 ;D_bar
TEXT 2088 -96 Right 2 ;D
TEXT 2200 88 Right 2 ;D
TEXT 1792 72 Right 2 ;Q
TEXT 2400 96 Right 2 ;D
TEXT 2368 872 Right 2 ;CLK
TEXT 2424 1176 Right 2 ;CLK_bar
TEXT 1904 768 Right 2 ;D_bar
TEXT 2120 800 Right 2 ;D
TEXT 2232 984 Right 2 ;D
TEXT 1824 968 Right 2 ;Q
TEXT 2432 992 Right 2 ;D
TEXT 1456 -24 Right 2 ;CLK
TEXT 1512 280 Right 2 ;CLK_bar
TEXT 992 -128 Right 2 ;D_bar
TEXT 1208 -96 Right 2 ;D
TEXT 1320 88 Right 2 ;D
TEXT 912 72 Right 2 ;Q
TEXT 1520 96 Right 2 ;D
TEXT 1488 872 Right 2 ;CLK
TEXT 1544 1176 Right 2 ;CLK_bar
TEXT 1024 768 Right 2 ;D_bar
TEXT 1240 800 Right 2 ;D
TEXT 1352 984 Right 2 ;D
TEXT 944 968 Right 2 ;Q
TEXT 1552 992 Right 2 ;D
TEXT 2832 -8 Right 2 ;CLK
TEXT 2824 344 Right 2 ;CLK_bar
TEXT 3120 736 Left 2 ;w1
TEXT 3376 1152 Left 2 ;w2
TEXT 3120 1152 Left 2 ;w3
TEXT 2464 120 Left 2 ;-w0
TEXT 1560 96 Left 2 ;-w1
TEXT 2464 1032 Left 2 ;-w2
TEXT 1552 1056 Left 2 ;-w3
TEXT -352 56 Right 2 ;CLK
TEXT -296 360 Right 2 ;CLK_bar
TEXT -816 -48 Right 2 ;D_bar
TEXT -600 -16 Right 2 ;D
TEXT -488 168 Right 2 ;D
TEXT -896 152 Right 2 ;Q
TEXT -288 176 Right 2 ;D
TEXT -320 952 Right 2 ;CLK
TEXT -264 1256 Right 2 ;CLK_bar
TEXT -784 848 Right 2 ;D_bar
TEXT -568 880 Right 2 ;D
TEXT -456 1064 Right 2 ;D
TEXT -864 1048 Right 2 ;Q
TEXT -256 1072 Right 2 ;D
TEXT -1232 56 Right 2 ;CLK
TEXT -1176 360 Right 2 ;CLK_bar
TEXT -1696 -48 Right 2 ;D_bar
TEXT -1480 -16 Right 2 ;D
TEXT -1368 168 Right 2 ;D
TEXT -1776 152 Right 2 ;Q
TEXT -1168 176 Right 2 ;D
TEXT -1200 952 Right 2 ;CLK
TEXT -1144 1256 Right 2 ;CLK_bar
TEXT -1664 848 Right 2 ;D_bar
TEXT -1448 880 Right 2 ;D
TEXT -1336 1064 Right 2 ;D
TEXT -1744 1048 Right 2 ;Q
TEXT -1136 1072 Right 2 ;D
TEXT 144 72 Right 2 ;CLK
TEXT 136 424 Right 2 ;CLK_bar
TEXT 432 816 Left 2 ;w1
TEXT 688 1232 Left 2 ;w2
TEXT 432 1232 Left 2 ;w3
TEXT -224 200 Left 2 ;-w0
TEXT -1128 176 Left 2 ;-w1
TEXT -224 1112 Left 2 ;-w2
TEXT -1136 1136 Left 2 ;-w3
TEXT 1752 -8 Left 5 ;Y0
TEXT 872 8 Left 5 ;Y1
TEXT 1776 896 Left 5 ;Y2
TEXT 904 888 Left 5 ;Y3
TEXT -936 96 Left 5 ;Y4
TEXT -1840 80 Left 5 ;Y5
TEXT -912 960 Left 5 ;Y6
TEXT -1792 984 Left 5 ;Y7
TEXT 680 840 Left 2 ;w0
TEXT 3368 768 Left 2 ;w0
TEXT 4008 -264 Left 2 !* LOT: n94s                  WAF: 08\n* Temperature_parameters=Default\n.MODEL nmos nmos LEVEL = 8\n+VERSION = 3.1            TNOM    = 27             TOX     = 5.8E-9\n+XJ      = 1E-7           NCH     = 2.3549E17      VTH0    = 0.4308936\n+K1      = 0.3519429      K2      = 0.0298493      K3      = 1E-3\n+K3B     = 0.0592323      W0      = 1E-5           NLX     = 1.465901E-7\n+DVT0W   = 0              DVT1W   = 0              DVT2W   = 0\n+DVT0    = 0.0183405      DVT1    = 4.897584E-3    DVT2    = -0.0252658\n+U0      = 455.3033362    UA      = 5.223592E-10   UB      = 1.104713E-18\n+UC      = 3.287888E-11   VSAT    = 1.050993E5     A0      = 1.2318623\n+AGS     = 0.3043334      B0      = 6.67749E-8     B1      = 5E-6\n+KETA    = 8.518046E-4    A1      = 0              A2      = 1\n+RDSW    = 509.5675851    PRWG    = 0.0227558      PRWB    = -1E-3\n+WR      = 1              WINT    = 2.126497E-9    LINT    = 4.393474E-9\n+XL      = -3E-8          XW      = 0              DWG     = -3.409033E-9\n+DWB     = 2.794842E-9    VOFF    = -0.1026054     NFACTOR = 0.1344887\n+CIT     = 0              CDSC    = 1.527511E-3    CDSCD   = 0\n+CDSCB   = 0              ETA0    = 3.48737E-3     ETAB    = 4.557986E-4\n+DSUB    = 3.045473E-3    PCLM    = 1.0446257      PDIBLC1 = 0.1441952\n+PDIBLC2 = 4.513382E-4    PDIBLCB = -2.816756E-5   DROUT   = 0.4698725\n+PSCBE1  = 1.761109E10    PSCBE2  = 3.772916E-9    PVAG    = 0.0361824\n+DELTA   = 0.01           MOBMOD  = 1              PRT     = 0\n+UTE     = -1.5           KT1     = -0.11          KT1L    = 0\n+KT2     = 0.022          UA1     = 4.31E-9        UB1     = -7.61E-18\n+UC1     = -5.6E-11       AT      = 3.3E4          WL      = 0\n+WLN     = 1              WW      = 0              WWN     = 1\n+WWL     = 0              LL      = 0              LLN     = 1\n+LW      = 0              LWN     = 1              LWL     = 0\n+CAPMOD  = 2              XPART   = 0.4            CGDO    = 6.27E-10\n+CGSO    = 6.27E-10       CGBO    = 0              CJ      = 1.918655E-3\n+PB      = 0.9784049      MJ      = 0.4721729      CJSW    = 4.441595E-10\n+PBSW    = 0.9419636      MJSW    = 0.2871118      PVTH0   = 1.342985E-3\n+PRDSW   = -61.8357222    PK2     = -3.140724E-3   WKETA   = 7.512693E-4\n+LKETA   = -6.144062E-3
TEXT 4968 -280 Left 2 !* LOT: n94s                  WAF: 08\n* Temperature_parameters=Default\n.MODEL pmos pmos LEVEL = 8\n+VERSION = 3.1            TNOM    = 27             TOX     = 5.8E-9\n+XJ      = 1E-7           NCH     = 4.1589E17      VTH0    = -0.6158735\n+K1      = 0.4598379      K2      = 0.0399415      K3      = 0\n+K3B     = 8.7410723      W0      = 1E-6           NLX     = 1E-9\n+DVT0W   = 0              DVT1W   = 0              DVT2W   = 0\n+DVT0    = 0.6249485      DVT1    = 0.203296       DVT2    = -0.0513763\n+U0      = 158.67524      UA      = 2.200024E-10   UB      = 4.457415E-18\n+UC      = 1.02138E-10    VSAT    = 1.85064E5      A0      = 1.3826397\n+AGS     = 0.4192977      B0      = 2.844099E-6    B1      = 5E-6\n+KETA    = 0.0208695      A1      = 0              A2      = 1\n+RDSW    = 968.5463       PRWG    = -0.1026483     PRWB    = -0.325\n+WR      = 1              WINT    = 2.748811E-8    LINT    = 8.71907E-9\n+XL      = -3E-8          XW      = 0              DWG     = -4.087585E-8\n+DWB     = 2.032008E-8    VOFF    = -0.15          NFACTOR = 1.5460516\n+CIT     = 0              CDSC    = 1.413317E-4    CDSCD   = 0\n+CDSCB   = 0              ETA0    = 0.3241245      ETAB    = -0.1842\n+DSUB    = 1.0287138      PCLM    = 5.2654567      PDIBLC1 = 4.228338E-3\n+PDIBLC2 = 1.204519E-3    PDIBLCB = 2.37525E-3     DROUT   = 0\n+PSCBE1  = 3.011456E10    PSCBE2  = 3.037042E-7    PVAG    = 8.9564294\n+DELTA   = 0.01           MOBMOD  = 1              PRT     = 0\n+UTE     = -1.5           KT1     = -0.11          KT1L    = 0\n+KT2     = 0.022          UA1     = 4.31E-9        UB1     = -7.61E-18\n+UC1     = -5.6E-11       AT      = 3.3E4          WL      = 0\n+WLN     = 1              WW      = 0              WWN     = 1\n+WWL     = 0              LL      = 0              LLN     = 1\n+LW      = 0              LWN     = 1              LWL     = 0\n+CAPMOD  = 2              XPART   = 0.4            CGDO    = 5.59E-10\n+CGSO    = 5.59E-10       CGBO    = 0              CJ      = 1.882857E-3\n+PB      = 0.9891317      MJ      = 0.4679789      CJSW    = 3.67186E-10\n+PBSW    = 0.9884654      MJSW    = 0.3562128      PVTH0   = 3.923756E-3\n+PRDSW   = 15.3953053     PK2     = 2.061759E-3    WKETA   = 4.10049E-3\n+LKETA   = -0.0232426     LVSAT   = 1.257E5

The netlist it stands for:
* 8-bit_Memory.asc
M1 N006 Clk N011 N002 PMOS l=180n w=6000n
M2 N011 Clk_bar N006 0 NMOS l=180n w=6000n
M3 N002 N006 Y0 N002 PMOS l=180n w=3520n
M4 Y0 N006 0 0 NMOS l=180n w=1760n
M5 N006 Y0 N002 N002 PMOS l=180n w=880n
M6 0 Y0 N006 0 NMOS l=180n w=440n
V1 N002 0 1.8V
C1 N006 0 1fF
C2 Y0 0 1fF
M7 N021 Clk N024 N017 PMOS l=180n w=6000n
M8 N024 Clk_bar N021 0 NMOS l=180n w=6000n
M9 N017 N021 Y2 N017 PMOS l=180n w=3520n
M10 Y2 N021 0 0 NMOS l=180n w=1760n
M11 N021 Y2 N017 N017 PMOS l=180n w=880n
M12 0 Y2 N021 0 NMOS l=180n w=440n
V2 N017 0 1.8V
C3 N021 0 1fF
C4 Y2 0 1fF
M13 N005 Clk N009 N001 PMOS l=180n w=6000n
M14 N009 Clk_bar N005 0 NMOS l=180n w=6000n
M15 N001 N005 Y1 N001 PMOS l=180n w=3520n
M16 Y1 N005 0 0 NMOS l=180n w=1760n
M17 N005 Y1 N001 N001 PMOS l=180n w=880n
M18 0 Y1 N005 0 NMOS l=180n w=440n
V3 N001 0 1.8V
C5 N005 0 1fF
C6 Y1 0 1fF
M19 N020 Clk N025 N016 PMOS l=180n w=6000n
M20 N025 Clk_bar N020 0 NMOS l=180n w=6000n
M21 N016 N020 Y3 N016 PMOS l=180n w=3520n
M22 Y3 N020 0 0 NMOS l=180n w=1760n
M23 N020 Y3 N016 N016 PMOS l=180n w=880n
M24 0 Y3 N020 0 NMOS l=180n w=440n
V4 N016 0 1.8V
C7 N020 0 1fF
C8 Y3 0 1fF
V5 N010 0 1.8V
M27 N010 w2 N024 N010 PMOS l=180n w=4000n
M28 N024 w2 0 0 NMOS l=180n w=2000n
M29 N010 w0 N011 N010 PMOS l=180n w=4000n
M30 N011 w0 0 0 NMOS l=180n w=2000n
M31 N025 w3 0 0 NMOS l=180n w=2000n
M32 N010 w3 N025 N010 PMOS l=180n w=4000n
M33 N010 w1 N009 N010 PMOS l=180n w=4000n
M34 N009 w1 0 0 NMOS l=180n w=2000n
M35 N008 Clk N014 N004 PMOS l=180n w=6000n
M36 N014 N015 N008 0 NMOS l=180n w=6000n
M37 N004 N008 Y4 N004 PMOS l=180n w=3520n
M38 Y4 N008 0 0 NMOS l=180n w=1760n
M39 N008 Y4 N004 N004 PMOS l=180n w=880n
M40 0 Y4 N008 0 NMOS l=180n w=440n
V6 N004 0 1.8V
C9 N008 0 1fF
C10 Y4 0 1fF
M41 N023 Clk N026 N019 PMOS l=180n w=6000n
M42 N026 N015 N023 0 NMOS l=180n w=6000n
M43 N019 N023 Y6 N019 PMOS l=180n w=3520n
M44 Y6 N023 0 0 NMOS l=180n w=1760n
M45 N023 Y6 N019 N019 PMOS l=180n w=880n
M46 0 Y6 N023 0 NMOS l=180n w=440n
V7 N019 0 1.8V
C11 N023 0 1fF
C12 Y6 0 1fF
M47 N007 Clk N012 N003 PMOS l=180n w=6000n
M48 N012 N015 N007 0 NMOS l=180n w=6000n
M49 N003 N007 Y5 N003 PMOS l=180n w=3520n
M50 Y5 N007 0 0 NMOS l=180n w=1760n
M51 N007 Y5 N003 N003 PMOS l=180n w=880n
M52 0 Y5 N007 0 NMOS l=180n w=440n
V8 N003 0 1.8V
C13 N007 0 1fF
C14 Y5 0 1fF
M53 N022 Clk N027 N018 PMOS l=180n w=6000n
M54 N027 N015 N022 0 NMOS l=180n w=6000n
M55 N018 N022 Y7 N018 PMOS l=180n w=3520n
M56 Y7 N022 0 0 NMOS l=180n w=1760n
M57 N022 Y7 N018 N018 PMOS l=180n w=880n
M58 0 Y7 N022 0 NMOS l=180n w=440n
V9 N018 0 1.8V
C15 N022 0 1fF
C16 Y7 0 1fF
V10 N013 0 1.8V
M59 N013 Clk N015 N013 PMOS l=180n w=8800n
M60 N015 Clk 0 0 NMOS l=180n w=4400n
M61 N013 w6 N026 N013 PMOS l=180n w=4000n
M62 N026 w6 0 0 NMOS l=180n w=2000n
M63 N013 w4 N014 N013 PMOS l=180n w=4000n
M64 N014 w4 0 0 NMOS l=180n w=2000n
M65 N027 w7 0 0 NMOS l=180n w=2000n
M66 N013 w7 N027 N013 PMOS l=180n w=4000n
M67 N013 w5 N012 N013 PMOS l=180n w=4000n
M68 N012 w5 0 0 NMOS l=180n w=2000n
.model NMOS NMOS
.model PMOS PMOS
.lib standard.mos
* CLK
* CLK_bar
* D_bar
* D
* D
* Q
* D
* CLK
* CLK_bar
* D_bar
* D
* D
* Q
* D
* CLK
* CLK_bar
* D_bar
* D
* D
* Q
* D
* CLK
* CLK_bar
* D_bar
* D
* D
* Q
* D
* CLK
* CLK_bar
* w1
* w2
* w3
* -w0
* -w1
* -w2
* -w3
* CLK
* CLK_bar
* D_bar
* D
* D
* Q
* D
* CLK
* CLK_bar
* D_bar
* D
* D
* Q
* D
* CLK
* CLK_bar
* D_bar
* D
* D
* Q
* D
* CLK
* CLK_bar
* D_bar
* D
* D
* Q
* D
* CLK
* CLK_bar
* w1
* w2
* w3
* -w0
* -w1
* -w2
* -w3
* Y0
* Y1
* Y2
* Y3
* Y4
* Y5
* Y6
* Y7
* w0
* w0
* LOT: n94s                  WAF: 08
* Temperature_parameters=Default
.MODEL nmos nmos LEVEL = 8
+VERSION = 3.1            TNOM    = 27             TOX     = 5.8E-9
+XJ      = 1E-7           NCH     = 2.3549E17      VTH0    = 0.4308936
+K1      = 0.3519429      K2      = 0.0298493      K3      = 1E-3
+K3B     = 0.0592323      W0      = 1E-5           NLX     = 1.465901E-7
+DVT0W   = 0              DVT1W   = 0              DVT2W   = 0
+DVT0    = 0.0183405      DVT1    = 4.897584E-3    DVT2    = -0.0252658
+U0      = 455.3033362    UA      = 5.223592E-10   UB      = 1.104713E-18
+UC      = 3.287888E-11   VSAT    = 1.050993E5     A0      = 1.2318623
+AGS     = 0.3043334      B0      = 6.67749E-8     B1      = 5E-6
+KETA    = 8.518046E-4    A1      = 0              A2      = 1
+RDSW    = 509.5675851    PRWG    = 0.0227558      PRWB    = -1E-3
+WR      = 1              WINT    = 2.126497E-9    LINT    = 4.393474E-9
+XL      = -3E-8          XW      = 0              DWG     = -3.409033E-9
+DWB     = 2.794842E-9    VOFF    = -0.1026054     NFACTOR = 0.1344887
+CIT     = 0              CDSC    = 1.527511E-3    CDSCD   = 0
+CDSCB   = 0              ETA0    = 3.48737E-3     ETAB    = 4.557986E-4
+DSUB    = 3.045473E-3    PCLM    = 1.0446257      PDIBLC1 = 0.1441952
+PDIBLC2 = 4.513382E-4    PDIBLCB = -2.816756E-5   DROUT   = 0.4698725
+PSCBE1  = 1.761109E10    PSCBE2  = 3.772916E-9    PVAG    = 0.0361824
+DELTA   = 0.01           MOBMOD  = 1              PRT     = 0
+UTE     = -1.5           KT1     = -0.11          KT1L    = 0
+KT2     = 0.022          UA1     = 4.31E-9        UB1     = -7.61E-18
+UC1     = -5.6E-11       AT      = 3.3E4          WL      = 0
+WLN     = 1              WW      = 0              WWN     = 1
+WWL     = 0              LL      = 0              LLN     = 1
+LW      = 0              LWN     = 1              LWL     = 0
+CAPMOD  = 2              XPART   = 0.4            CGDO    = 6.27E-10
+CGSO    = 6.27E-10       CGBO    = 0              CJ      = 1.918655E-3
+PB      = 0.9784049      MJ      = 0.4721729      CJSW    = 4.441595E-10
+PBSW    = 0.9419636      MJSW    = 0.2871118      PVTH0   = 1.342985E-3
+PRDSW   = -61.8357222    PK2     = -3.140724E-3   WKETA   = 7.512693E-4
+LKETA   = -6.144062E-3
* LOT: n94s                  WAF: 08
* Temperature_parameters=Default
.MODEL pmos pmos LEVEL = 8
+VERSION = 3.1            TNOM    = 27             TOX     = 5.8E-9
+XJ      = 1E-7           NCH     = 4.1589E17      VTH0    = -0.6158735
+K1      = 0.4598379      K2      = 0.0399415      K3      = 0
+K3B     = 8.7410723      W0      = 1E-6           NLX     = 1E-9
+DVT0W   = 0              DVT1W   = 0              DVT2W   = 0
+DVT0    = 0.6249485      DVT1    = 0.203296       DVT2    = -0.0513763
+U0      = 158.67524      UA      = 2.200024E-10   UB      = 4.457415E-18
+UC      = 1.02138E-10    VSAT    = 1.85064E5      A0      = 1.3826397
+AGS     = 0.4192977      B0      = 2.844099E-6    B1      = 5E-6
+KETA    = 0.0208695      A1      = 0              A2      = 1
+RDSW    = 968.5463       PRWG    = -0.1026483     PRWB    = -0.325
+WR      = 1              WINT    = 2.748811E-8    LINT    = 8.71907E-9
+XL      = -3E-8          XW      = 0              DWG     = -4.087585E-8
+DWB     = 2.032008E-8    VOFF    = -0.15          NFACTOR = 1.5460516
+CIT     = 0              CDSC    = 1.413317E-4    CDSCD   = 0
+CDSCB   = 0              ETA0    = 0.3241245      ETAB    = -0.1842
+DSUB    = 1.0287138      PCLM    = 5.2654567      PDIBLC1 = 4.228338E-3
+PDIBLC2 = 1.204519E-3    PDIBLCB = 2.37525E-3     DROUT   = 0
+PSCBE1  = 3.011456E10    PSCBE2  = 3.037042E-7    PVAG    = 8.9564294
+DELTA   = 0.01           MOBMOD  = 1              PRT     = 0
+UTE     = -1.5           KT1     = -0.11          KT1L    = 0
+KT2     = 0.022          UA1     = 4.31E-9        UB1     = -7.61E-18
+UC1     = -5.6E-11       AT      = 3.3E4          WL      = 0
+WLN     = 1              WW      = 0              WWN     = 1
+WWL     = 0              LL      = 0              LLN     = 1
+LW      = 0              LWN     = 1              LWL     = 0
+CAPMOD  = 2              XPART   = 0.4            CGDO    = 5.59E-10
+CGSO    = 5.59E-10       CGBO    = 0              CJ      = 1.882857E-3
+PB      = 0.9891317      MJ      = 0.4679789      CJSW    = 3.67186E-10
+PBSW    = 0.9884654      MJSW    = 0.3562128      PVTH0   = 3.923756E-3
+PRDSW   = 15.3953053     PK2     = 2.061759E-3    WKETA   = 4.10049E-3
+LKETA   = -0.0232426     LVSAT   = 1.257E5
.backanno
.end